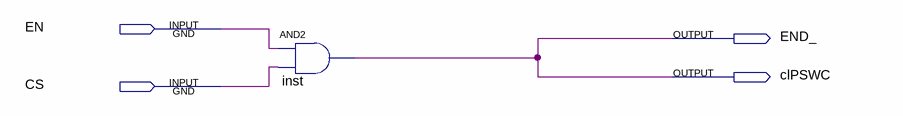
[diagram p0: schematic sheet]
// Quartus schematic CLC.bdf as structural Verilog: 1 symbols, 4 pins
module CLC (
  input  EN,
  input  CS,
  output END_,
  output clPSWC
);

  and inst (clPSWC, EN, CS);

  assign END_ = clPSWC;
endmodule
